# EAGLE schematic AquaTempSchema (EAGLE 6.5.0)
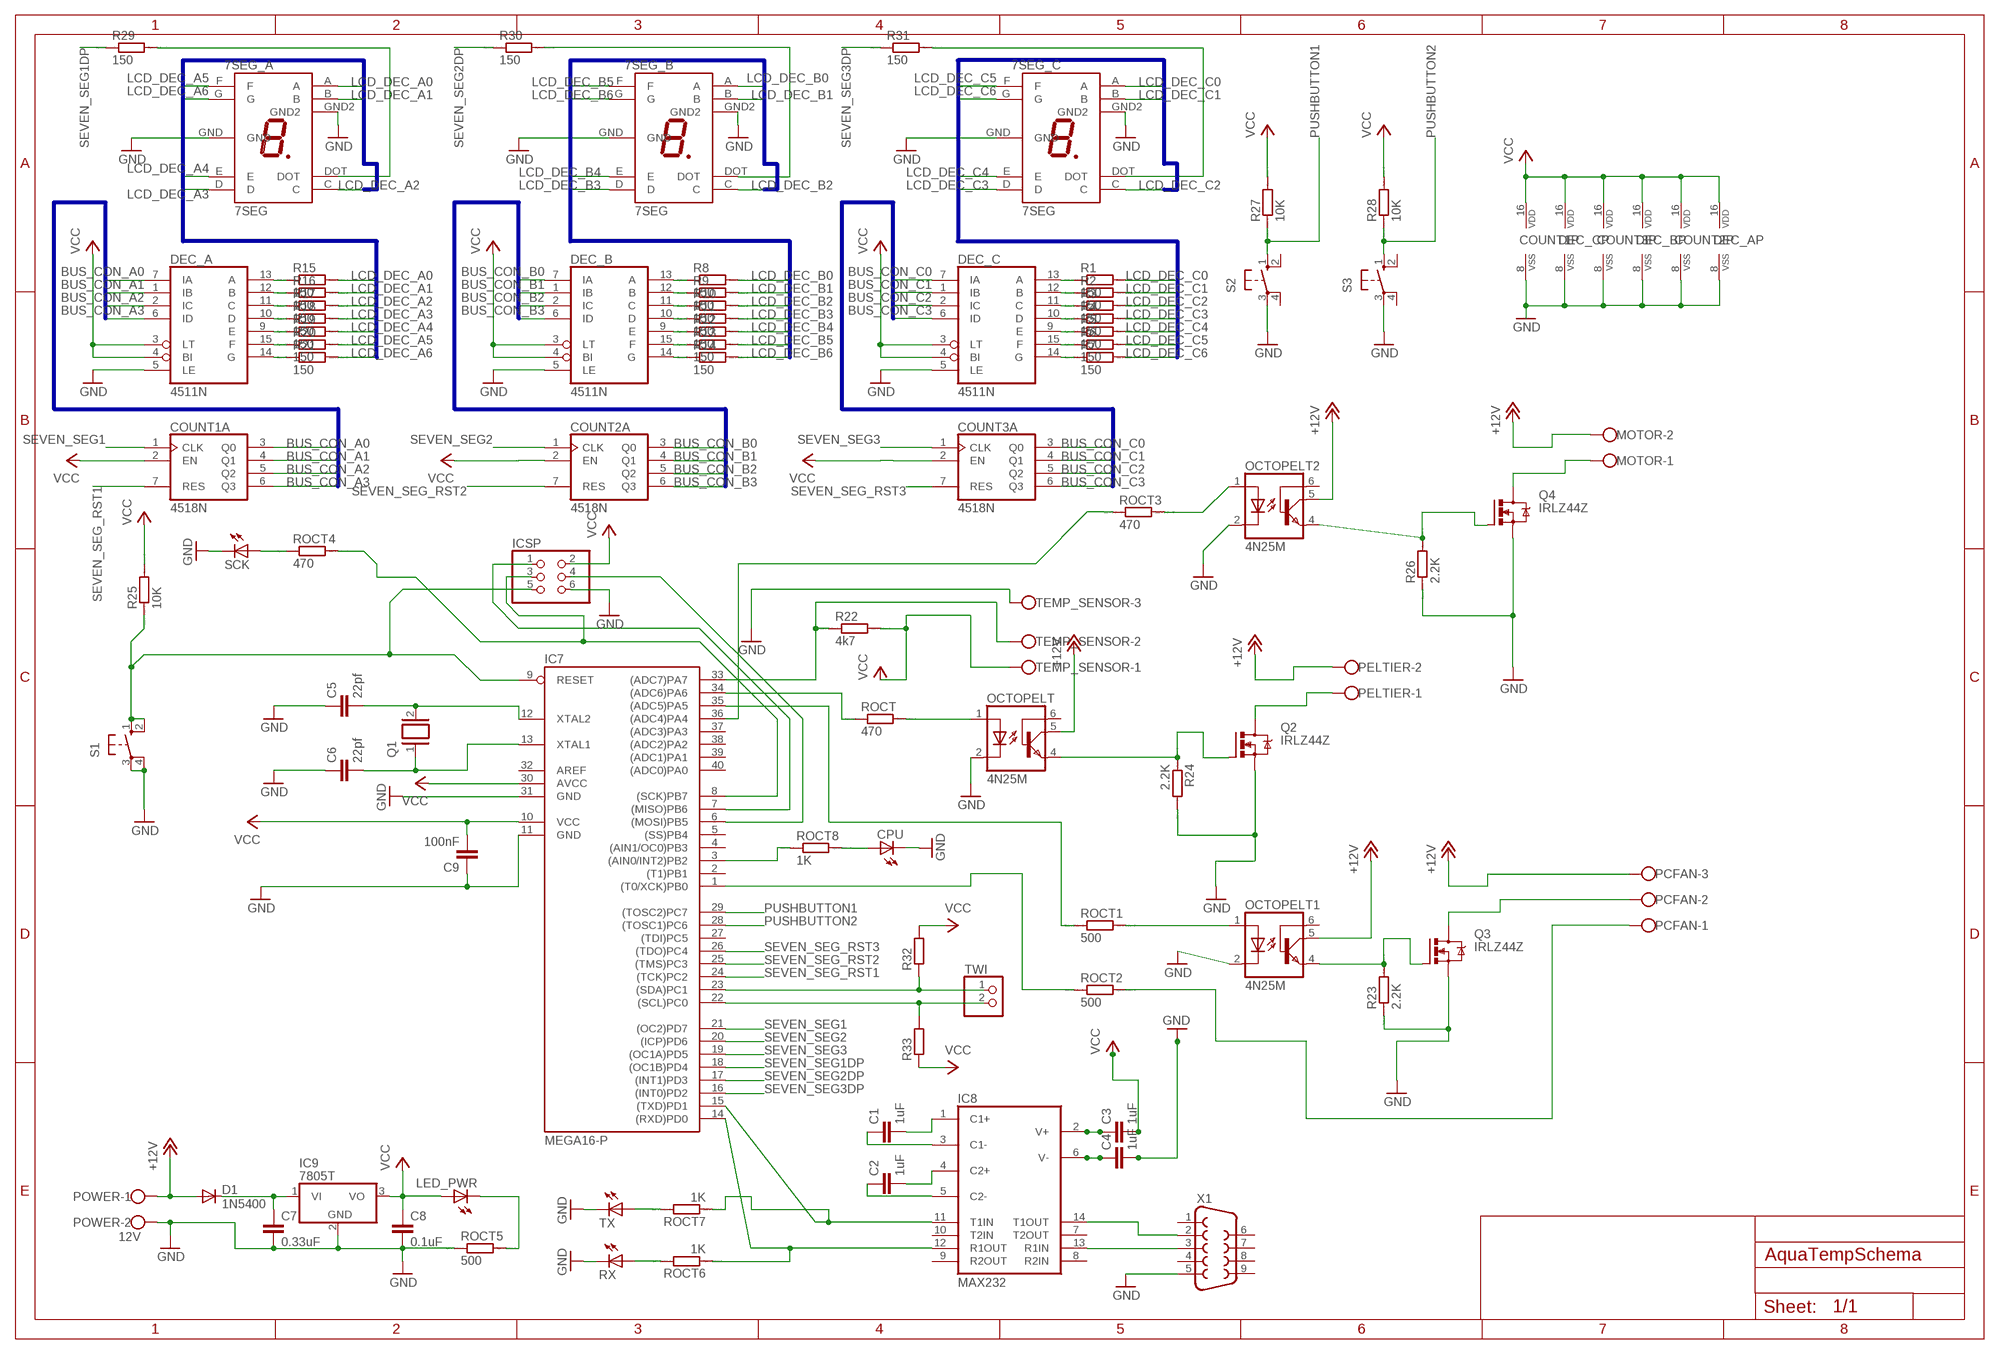
[diagram p0: schematic, sheet 1]

## Parts
7SEG_A  7SEG  7SEGLED7SEGMENTOSLED  [7SEGMENTOSDIP]
7SEG_B  7SEG  7SEGLED7SEGMENTOSLED  [7SEGMENTOSDIP]
7SEG_C  7SEG  7SEGLED7SEGMENTOSLED  [7SEGMENTOSDIP]
C1  1uF  C2,5-3  [C2.5-3]
C2  1uF  C2,5-3  [C2.5-3]
C3  1uF  C2,5-3  [C2.5-3]
C4  1uF  C2,5-3  [C2.5-3]
C5  22pf  C2,5-3  [C2.5-3]
C6  22pf  C2,5-3  [C2.5-3]
C7  0.33uF  C2,5-3  [C2.5-3]
C8  0.1uF  C2,5-3  [C2.5-3]
C9  100nF  C2,5-3  [C2.5-3]
COUNT1  4518N  [DIL16]
COUNT2  4518N  [DIL16]
COUNT3  4518N  [DIL16]
CPU  LED5MM  [LED5MM]
D1  1N5400  [DO201-15]
DEC_A  4511N  [DIL16]
DEC_B  4511N  [DIL16]
DEC_C  4511N  [DIL16]
IC7  MEGA16-P  [DIL40]
IC8  MAX232  [DIL16]
IC9  7805T  [TO220H]
ICSP  PINHD-2X3  [2X03]
LED_PWR  LED5MM  [LED5MM]
MOTOR  W237-102  [W237-102]
OCTOPELT  4N25M  [DIL06]
OCTOPELT1  4N25M  [DIL06]
OCTOPELT2  4N25M  [DIL06]
PCFAN  W237-103  [W237-103]
PELTIER  W237-102  [W237-102]
POWER  12V  W237-102  [W237-102]
Q1  XTAL  [Q]
Q2  IRLZ44Z  [TO220BH]
Q3  IRLZ44Z  [TO220BH]
Q4  IRLZ44Z  [TO220BH]
R1  150  R0207/10  [0207/10]
R2  150  R0207/10  [0207/10]
R3  150  R0207/10  [0207/10]
R4  150  R0207/10  [0207/10]
R5  150  R0207/10  [0207/10]
R6  150  R0207/10  [0207/10]
R7  150  R0207/10  [0207/10]
R8  150  R0207/10  [0207/10]
R9  150  R0207/10  [0207/10]
R10  150  R0207/10  [0207/10]
R11  150  R0207/10  [0207/10]
R12  150  R0207/10  [0207/10]
R13  150  R0207/10  [0207/10]
R14  150  R0207/10  [0207/10]
R15  150  R0207/10  [0207/10]
R16  150  R0207/10  [0207/10]
R17  150  R0207/10  [0207/10]
R18  150  R0207/10  [0207/10]
R19  150  R0207/10  [0207/10]
R20  150  R0207/10  [0207/10]
R21  150  R0207/10  [0207/10]
R22  4k7  R0204/7  [0204/7]
R23  2.2K  R0204/7  [0204/7]
R24  2.2K  R0204/7  [0204/7]
R25  10K  R0204/7  [0204/7]
R26  2.2K  R0204/7  [0204/7]
R27  10K  R0204/7  [0204/7]
R28  10K  R0204/7  [0204/7]
R29  150  R0207/10  [0207/10]
R30  150  R0207/10  [0207/10]
R31  150  R0207/10  [0207/10]
R32  R-EU_0207/10  [0207/10]
R33  R-EU_0207/10  [0207/10]
ROCT  470  R0204/7  [0204/7]
ROCT1  500  R0204/7  [0204/7]
ROCT2  500  R0204/7  [0204/7]
ROCT3  470  R0204/7  [0204/7]
ROCT4  470  R0204/7  [0204/7]
ROCT5  500  R0204/7  [0204/7]
ROCT6  1K  R0204/7  [0204/7]
ROCT7  1K  R0204/7  [0204/7]
ROCT8  1K  R0204/7  [0204/7]
RX  LED5MM  [LED5MM]
S1  10-XX  [B3F-10XX]
S2  10-XX  [B3F-10XX]
S3  10-XX  [B3F-10XX]
SCK  LED5MM  [LED5MM]
TEMP_SENSOR  W237-103  [W237-103]
TWI  PINHD-1X2/90  [1X02/90]
TX  LED5MM  [LED5MM]
X1  F09H  [F09H]

## Nets
+12V [+12V]: D1.A MOTOR.2 OCTOPELT1.5(COL) OCTOPELT2.5(COL) OCTOPELT.5(COL) PCFAN.3 PELTIER.2 POWER.1
BUS_CON_A0: COUNT1.3(A:Q0) DEC_A.7(IA)
BUS_CON_A1: COUNT1.4(A:Q1) DEC_A.1(IB)
BUS_CON_A2: COUNT1.5(A:Q2) DEC_A.2(IC)
BUS_CON_A3: COUNT1.6(A:Q3) DEC_A.6(ID)
BUS_CON_B0: COUNT2.3(A:Q0) DEC_B.7(IA)
BUS_CON_B1: COUNT2.4(A:Q1) DEC_B.1(IB)
BUS_CON_B2: COUNT2.5(A:Q2) DEC_B.2(IC)
BUS_CON_B3: COUNT2.6(A:Q3) DEC_B.6(ID)
BUS_CON_C0: COUNT3.3(A:Q0) DEC_C.7(IA)
BUS_CON_C1: COUNT3.4(A:Q1) DEC_C.1(IB)
BUS_CON_C2: COUNT3.5(A:Q2) DEC_C.2(IC)
BUS_CON_C3: COUNT3.6(A:Q3) DEC_C.6(ID)
CPU: IC7.35((ADC5)PA5) ROCT1.1
GND [AGND]: 7SEG_A.GND 7SEG_A.GND2 7SEG_B.GND 7SEG_B.GND2 7SEG_C.GND 7SEG_C.GND2 C4.2 C5.1 C6.1 C7.2 C8.2 C9.1 COUNT1.8(P:VSS) COUNT2.8(P:VSS) COUNT3.8(P:VSS) CPU.K(C) DEC_A.5(LE) DEC_A.8(VSS) DEC_B.5(LE) DEC_B.8(VSS) DEC_C.5(LE) DEC_C.8(VSS) IC7.11(GND) IC7.31(GND) IC9.2(GND) ICSP.6 OCTOPELT1.2(C) OCTOPELT2.2(C) OCTOPELT.2(C) POWER.2 Q2.S Q3.S Q4.S R23.1 R24.2 R26.1 ROCT5.1 RX.K(C) S1.3(P) S1.4(P1) S2.3(P) S3.3(P) SCK.K(C) TEMP_SENSOR.3 TX.K(C) X1.5
LCD_DEC_A0: 7SEG_A.A R15.2
LCD_DEC_A1: 7SEG_A.B R16.2
LCD_DEC_A2: 7SEG_A.C R17.2
LCD_DEC_A3: 7SEG_A.D R18.2
LCD_DEC_A4: 7SEG_A.E R19.2
LCD_DEC_A5: 7SEG_A.F R20.2
LCD_DEC_A6: 7SEG_A.G R21.2
LCD_DEC_B0: 7SEG_B.A R8.2
LCD_DEC_B1: 7SEG_B.B R9.2
LCD_DEC_B2: 7SEG_B.C R10.2
LCD_DEC_B3: 7SEG_B.D R11.2
LCD_DEC_B4: 7SEG_B.E R12.2
LCD_DEC_B5: 7SEG_B.F R13.2
LCD_DEC_B6: 7SEG_B.G R14.2
LCD_DEC_C0: 7SEG_C.A R1.2
LCD_DEC_C1: 7SEG_C.B R2.2
LCD_DEC_C2: 7SEG_C.C R3.2
LCD_DEC_C3: 7SEG_C.D R4.2
LCD_DEC_C4: 7SEG_C.E R5.2
LCD_DEC_C5: 7SEG_C.F R6.2
LCD_DEC_C6: 7SEG_C.G R7.2
N$1: DEC_C.13(A) R1.1
N$2: DEC_C.12(B) R2.1
N$3: DEC_C.11(C) R3.1
N$4: DEC_C.10(D) R4.1
N$5: DEC_C.9(E) R5.1
N$6: DEC_C.15(F) R6.1
N$7: DEC_C.14(G) R7.1
N$8: DEC_B.13(A) R8.1
N$9: DEC_B.12(B) R9.1
N$10: DEC_B.11(C) R10.1
N$11: DEC_B.10(D) R11.1
N$12: DEC_B.9(E) R12.1
N$13: DEC_B.15(F) R13.1
N$14: DEC_B.14(G) R14.1
N$15: DEC_A.13(A) R15.1
N$16: DEC_A.12(B) R16.1
N$17: DEC_A.11(C) R17.1
N$18: DEC_A.10(D) R18.1
N$19: DEC_A.9(E) R19.1
N$20: DEC_A.15(F) R20.1
N$21: DEC_A.14(G) R21.1
N$22: C1.1 IC8.3(C1-)
N$23: IC7.33((ADC7)PA7) R22.1 TEMP_SENSOR.2
N$24: C1.2 IC8.1(C1+)
N$25: C2.1 IC8.5(C2-)
N$26: C2.2 IC8.4(C2+)
N$27: C3.1 IC8.2(V+)
N$28: C4.1 IC8.6(V-)
N$29: IC7.14((RXD)PD0) IC8.12(R1OUT) ROCT6.1
N$30: 7SEG_A.DOT R29.2
N$31: IC8.14(T1OUT) X1.2
N$32: C6.2 IC7.13(XTAL1) Q1.1
N$33: C5.2 IC7.12(XTAL2) Q1.2
N$34: IC8.13(R1IN) X1.3
N$35: IC7.34((ADC6)PA6) ROCT.1
N$36: OCTOPELT.1(A) ROCT.2
N$37: OCTOPELT.4(EMI) Q2.G R24.1
N$38: OCTOPELT1.1(A) ROCT1.2
N$39 [AGND]: PELTIER.1 Q2.D
N$40: OCTOPELT1.4(EMI) Q3.G R23.2
N$41 [AGND]: PCFAN.2 Q3.D
N$42: 7SEG_B.DOT R30.2
N$43: PCFAN.1 ROCT2.2
N$44: IC7.1((T0/XCK)PB0) ROCT2.1
N$45: 7SEG_C.DOT R31.2
N$47: IC7.9(RESET) ICSP.5 R25.1 S1.1(S) S1.2(S1)
N$48: IC7.8((SCK)PB7) ICSP.3 ROCT4.2
N$49: IC7.6((MOSI)PB5) ICSP.4
N$50: IC7.7((MISO)PB6) ICSP.1
N$51: OCTOPELT2.4(EMI) Q4.G R26.2
N$52 [AGND]: MOTOR.1 Q4.D
N$54: OCTOPELT2.1(A) ROCT3.2
N$55: IC7.36((ADC4)PA4) ROCT3.1
N$56: ROCT4.1 SCK.A
N$57: C7.1 D1.C IC9.1(VI)
N$58: ROCT6.2 RX.A
N$59: LED_PWR.K(C) ROCT5.2
N$60: ROCT7.2 TX.A
N$61: IC7.15((TXD)PD1) IC8.11(T1IN) ROCT7.1
N$63: CPU.A ROCT8.2
N$65: IC7.3((AIN0/INT2)PB2) ROCT8.1
PUSHBUTTON1: IC7.29((TOSC2)PC7) R27.1 S2.1(S)
PUSHBUTTON2: IC7.28((TOSC1)PC6) R28.1 S3.1(S)
SCL_PIN: IC7.22((SCL)PC0) R33.2 TWI.2
SDA_PIN: IC7.23((SDA)PC1) R32.1 TWI.1
SEVEN_SEG1: COUNT1.1(A:CLK) IC7.21((OC2)PD7)
SEVEN_SEG1DP: IC7.18((OC1B)PD4) R29.1
SEVEN_SEG2: COUNT2.1(A:CLK) IC7.20((ICP)PD6)
SEVEN_SEG2DP: IC7.17((INT1)PD3) R30.1
SEVEN_SEG3: COUNT3.1(A:CLK) IC7.19((OC1A)PD5)
SEVEN_SEG3DP: IC7.16((INT0)PD2) R31.1
SEVEN_SEG_RST1: COUNT1.7(A:RES) IC7.24((TCK)PC2)
SEVEN_SEG_RST2: COUNT2.7(A:RES) IC7.25((TMS)PC3)
SEVEN_SEG_RST3: COUNT3.7(A:RES) IC7.26((TDO)PC4)
VCC: C3.2 C8.1 C9.2 COUNT1.2(A:EN) COUNT1.16(P:VDD) COUNT2.2(A:EN) COUNT2.16(P:VDD) COUNT3.2(A:EN) COUNT3.16(P:VDD) DEC_A.3(LT) DEC_A.4(BI) DEC_A.16(VDD) DEC_B.3(LT) DEC_B.4(BI) DEC_B.16(VDD) DEC_C.3(LT) DEC_C.4(BI) DEC_C.16(VDD) IC7.10(VCC) IC7.30(AVCC) IC9.3(VO) ICSP.2 LED_PWR.A R22.2 R25.2 R27.2 R28.2 R32.2 R33.1 TEMP_SENSOR.1
Unconnected: COUNT1.9(B:CLK) COUNT1.10(B:EN) COUNT1.11(B:Q0) COUNT1.12(B:Q1) COUNT1.13(B:Q2) COUNT1.14(B:Q3) COUNT1.15(B:RES) COUNT2.9(B:CLK) COUNT2.10(B:EN) COUNT2.11(B:Q0) COUNT2.12(B:Q1) COUNT2.13(B:Q2) COUNT2.14(B:Q3) COUNT2.15(B:RES) COUNT3.9(B:CLK) COUNT3.10(B:EN) COUNT3.11(B:Q0) COUNT3.12(B:Q1) COUNT3.13(B:Q2) COUNT3.14(B:Q3) COUNT3.15(B:RES) IC7.2((T1)PB1) IC7.4((AIN1/OC0)PB3) IC7.5((SS)PB4) IC7.27((TDI)PC5) IC7.32(AREF) IC7.37((ADC3)PA3) IC7.38((ADC2)PA2) IC7.39((ADC1)PA1) IC7.40((ADC0)PA0) IC8.7(T2OUT) IC8.8(R2IN) IC8.9(R2OUT) IC8.10(T2IN) OCTOPELT1.6(BAS) OCTOPELT2.6(BAS) OCTOPELT.6(BAS) S2.2(S1) S2.4(P1) S3.2(S1) S3.4(P1) X1.1 X1.4 X1.6 X1.7 X1.8 X1.9

## Buses
BUS_CON_A[0..3]
BUS_CON_B[0..3]
BUS_CON_C[0..3]
LCD_DEC_A[0..6]
LCD_DEC_B[0..6]
LCD_DEC_C[0..6]

## Power pins joined to a net without a drawn wire
GND: IC8.15(GND)
VCC: IC8.16(VCC)

## Library data of the parts
7SEG_A 7SEG_B 7SEG_C = PauloRB:7SEGLED
C1-C9 = capacitor-wima:C: CAPACITOR naming: grid - package width
COUNT1-COUNT3 = 45xx:4518: Dual BCD up COUNTER
CPU LED_PWR RX SCK TX = led:LED: LED OSRAM: - CHIPLED LG R971, LG N971, LY N971, LG Q971, LY Q971, LO R971, LY R971 LH N974, LH R974 LS Q976, LO Q976, LY Q976 LO Q996 - Hyper CHIPLED LW Q18S LB Q993, LB Q99A, LB R99A - SideLED LS A670, LO A670, LY A670, LG A670, LP A670 LB A673, LV A673, LT A673, LW A673 LH A674 LY A675 LS A676, LA A676, LO A676, LY A676, LW A676 LS A679, LY A679, LG A679 - Hyper Micro SIDELED® LS Y876, LA Y876, LO Y876, LY Y876 LT Y87S - SmartLED LW L88C, LW L88S LB L89C, LB L89S, LG L890 LS L89K, LO L89K, LY L89K LS L896, LA L896, LO L896, LY L896 - TOPLED LS T670, LO T670, LY T670, LG T670, LP T670 LSG T670, LSP T670, LSY T670, LOP T670, LYG T670 LG T671, LOG T671, LSG T671 LB T673, LV T673, LT T673, LW T673 LH T674 LS T676, LA T676, LO T676, LY T676, LB T676, LH T676, LSB T676, LW T676 LB T67C, LV T67C, LT T67C, LS T67K, LO T67K, LY T67K, LW E67C LS E67B, LA E67B, LO E67B, LY E67B, LB E67C, LV E67C, LT E67C LW T67C LS T679, LY T679, LG T679 LS T770, LO T770, LY T770, LG T770, LP T770 LB T773, LV T773, LT T773, LW T773 LH T774 LS E675, LA E675, LY E675, LS T675 LS T776, LA T776, LO T776, LY T776, LB T776 LHGB T686 LT T68C, LB T68C - Hyper Mini TOPLED® LB M676 - Mini TOPLED Santana® LG M470 LS M47K, LO M47K, LY M47K Source: http://www.osram.convergy.de LUXEON: - LUMILED® LXK2-PW12-R00, LXK2-PW12-S00, LXK2-PW14-U00, LXK2-PW14-V00 LXK2-PM12-R00, LXK2-PM12-S00, LXK2-PM14-U00 LXK2-PE12-Q00, LXK2-PE12-R00, LXK2-PE12-S00, LXK2-PE14-T00, LXK2-PE14-U00 LXK2-PB12-K00, LXK2-PB12-L00, LXK2-PB12-M00, LXK2-PB14-N00, LXK2-PB14-P00, LXK2-PB14-Q00 LXK2-PR12-L00, LXK2-PR12-M00, LXK2-PR14-Q00, LXK2-PR14-R00 LXK2-PD12-Q00, LXK2-PD12-R00, LXK2-PD12-S00 LXK2-PH12-R00, LXK2-PH12-S00 LXK2-PL12-P00, LXK2-PL12-Q00, LXK2-PL12-R00 Source: www.luxeon.com KINGBRIGHT: KA-3528ASYC Source: www.kingbright.com
D1 = diode:1N5400: DIODE standard rectifier, 3 A, 50 V (Motorola)
DEC_A DEC_B DEC_C = 45xx:4511: BCD to 7-segment LATCH/DECODER/DRIVER
IC7 = atmel:MEGA16-P: MICROCONTROLLER 16 Kbytes FLASH 1 kbytes SRAM 512 bytes EEPROM USART 8-channel 10 bit ADC Source: avr.lbr; MPN: ATMEGA16-16PU; OC_FARNELL: 9171142; OC_NEWARK: 01M6885
IC8 = maxim:MAX232: RS232 TRANSCEIVER; MF: MAXIM; MPN: MAX232ACPE+; OC_FARNELL: 9723773; OC_NEWARK: 68K4544
IC9 = linear:78*: Positive VOLTAGE REGULATOR Source: http://cache.national.com/ds/LM/LM78L05.pdf http://www.fairchildsemi.com/ds/LM/LM7805.pdf
ICSP = pinhead:PINHD-2X3: PIN HEADER
MOTOR PELTIER POWER = con-wago-500:W237-102: WAGO SCREW CLAMP; MPN: 237-102; OC_FARNELL: unknown; OC_NEWARK: 70K9898
OCTOPELT OCTOPELT1 OCTOPELT2 = optocoupler:4N*?M: General Purpose 6-Pin Phototransistor Optocouplers Source: http://www.fairchildsemi.com/ds/4N/4N35-M.pdf; MPN: 4N25-M; OC_FARNELL: 1021349; OC_NEWARK: 98K9084
PCFAN TEMP_SENSOR = con-wago-500:W237-103: WAGO SCREW CLAMP; MPN: 237-103; OC_FARNELL: unknown; OC_NEWARK: 18M7116
Q1 = special:XTAL: CRYSTAL
Q2-Q4 = transistor-power:IRLZ44Z: N-Channel HEXFET® Power MOSFET Logic Level AUTOMOTIVE MOSFET Source: http://www.irf.com/product-info/datasheets/data/irlz44zpbf.pdf
R1-R31 ROCT ROCT1-ROCT8 = eagle-ltspice:R: RESISTOR, European symbol; SPICEMODEL: NONE; SPICEPREFIX: R
R32 R33 = rcl:R-EU_: RESISTOR, European symbol
S1-S3 = switch-omron:10-XX: OMRON SWITCH; MPN: B3F-1000; OC_FARNELL: 176432; OC_NEWARK: 36M3542
TWI = pinhead:PINHD-1X2: PIN HEADER
X1 = con-subd:F09: SUB-D; OC_FARNELL: unknown; OC_NEWARK: unknown

## Net classes
0 default: clearance 0.205 mm
1 +12V: width 1 mm, clearance 0.205 mm to class 0, clearance 1 mm
2 AGND: width 1 mm, clearance 0.205 mm to class 0, clearance 0.205 mm to class 1, clearance 1 mm